# Altium project LiPo ATtiny Watch.PrjPcb
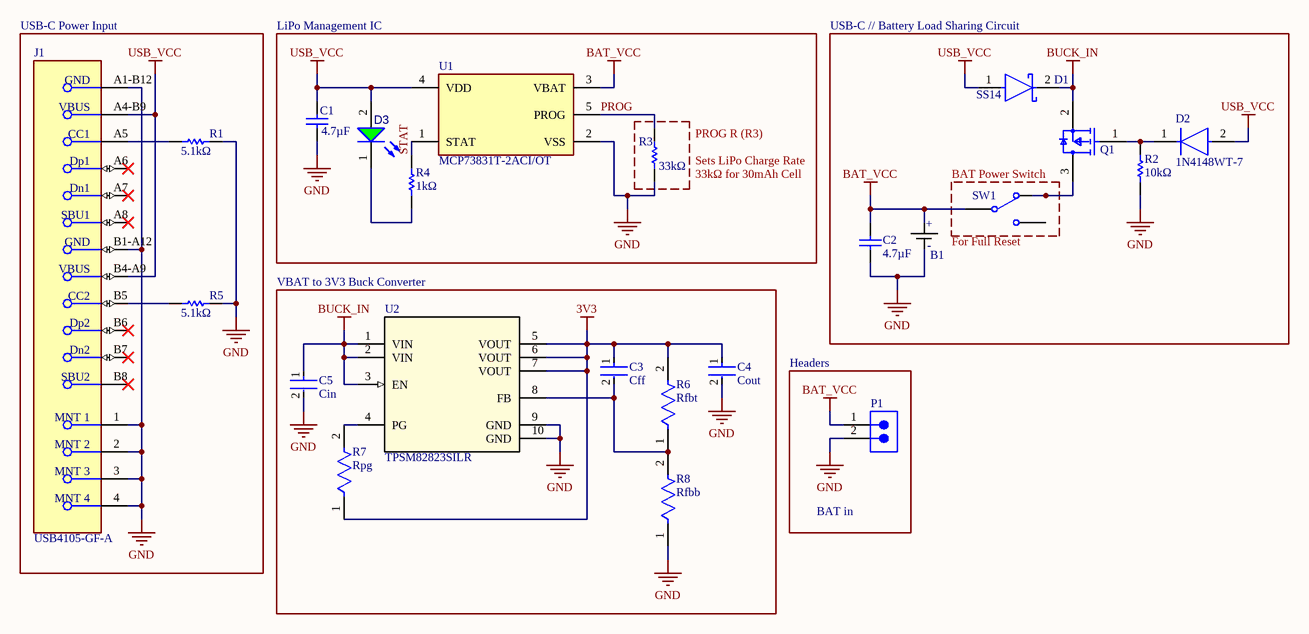
[diagram p0: LiPo BMS.SchDoc]
4 sheets, 49 parts. Net scope: flat (ports and power ports of the same name join across sheets).
Board file: PCB.PcbDoc
Sheets:
  LiPo BMS.SchDoc
  Microcontroller.SchDoc
  RTC IC.SchDoc
  Display.SchDoc

## Sheet LiPo BMS.SchDoc
size B; SheetNumber: 1; SheetTotal: 4

### Parts
B1  LiPo  (value not drawn)
C1  4.7µF  [CAPC1206(3216)190_L]
C2  4.7µF  [CAPC1206(3216)190_L]
C3  Cff  [FP-GRM033-0_03-IPC_A]
C4  Cout  [FP-C0805C-DG-MFG]
C5  Cin  [FP-GRM188-0_1-e0_2_0_55-IPC_A]
D1  SS14  [FP-403AE-MFG]
D2  1N4148WT-7  [FP-SOD523-MFG]
D3  150120GS75000  [WL-SMCW_1206_150120xx75000]  (value not drawn)
J1  USB4105-GF-A  [FP-USB4105-GF-A-MFG]
P1  61300211121  [61300211121]  (value not drawn)
Q1  IRLML6402TRPBF  [FP-Micro3-MFG]  (value not drawn)
R1  5.1kΩ  [RESC3116X65X40LL10T20]
R2  10kΩ  [RESC3116X65X40LL10T20]
R3  33kΩ  [RESC3116X65X40LL10T20]
R4  1kΩ  [RESC3116X65X40LL10T20]
R5  5.1kΩ  [RESC3116X65X40LL10T20]
R6  Rfbt  [FP-CRCW0402-e3-MFG]
R7  Rpg  [FP-CRCW0402-e3-IPC_C]
R8  Rfbb  [FP-CRCW0402-e3-IPC_C]
SW1  450404015514  [450404015514]  (value not drawn)
U1  MCP73831T-2ACI/OT  [FP-C04-091-OT-IPC_B]
U2  TPSM82823SILR  [SIL0010D-MFG]

### Blocks framed on the sheet
USB-C Power Input: J1 R1 R5
BAT Power Switch: SW1
VBAT to 3V3 Buck Converter: C3-C5 R6-R8 U2

### Nets
3V3: C3.1 C4.1 R6.2 R7.1 U2.5(VOUT) U2.6(VOUT) U2.7(VOUT)
BAT_VCC: B1.0(+) C2.2 P1.1 SW1.COM U1.3(VBAT)
BUCK_IN: C5.1 D1.2(C) Q1.2(S) U2.1(VIN) U2.2(VIN) U2.3(EN)
GND: B1.1(-) C1.1 C2.1 C4.2 C5.2 J1.1(MNT_1) J1.2(MNT_2) J1.3(MNT_3) J1.4(MNT_4) J1.A1-B12(GND) J1.B1-A12(GND) P1.2 R1.2 R2.1 R3.1 R5.2 R8.1 U1.2(VSS) U2.9(GND) U2.10(GND)
USB_VCC: C1.2 D1.1(A) D2.2(A) D3.2(A) J1.A4-B9(VBUS) J1.B4-A9(VBUS) U1.4(VDD)
PROG: R3.2 U1.5(PROG)
STAT: R4.1 U1.1(STAT)
NetC3_2: C3.2 R6.1 R8.2 U2.8(FB)
NetD2_1: D2.1(C) Q1.1(G) R2.2
NetD3_1: D3.1(K) R4.2
NetJ1_A5: J1.A5(CC1) R1.1
NetJ1_B5: J1.B5(CC2) R5.1
NetQ1_3: Q1.3(D) SW1.L1
NetR7_2: R7.2 U2.4(PG)

Not connected (* = marked no-connect by the designer): J1 A6(Dp1)* A7(Dn1)* A8(SBU1)* B6(Dp2)* B7(Dn2)* B8(SBU2)*; SW1 L2

### Notes on the sheet
- LiPo Management IC
- USB-C // Battery Load Sharing Circuit
- (near R3) PROG R (R3)
- (near R3) Sets LiPo Charge Rate
- (near R3) 33kΩ for 30mAh Cell
- (near SW1) For Full Reset
- Headers
- BAT in

### Library data of the parts
B1 = 3.7V 30mAh LiPo
C1 C2 = CMP-1037-04917-1: CAP 4.7uF 25V ±5% 1206 (3216 Metric) Thickness 1.9mm SMD; Tolerance: Â±5%; Case-Metric: 3216; Case-EIA: 1206; Max Thickness: 1.9 mm; Rated Voltage: 25 V; Value: 4.7uF; Technology: SMT
C3 = CMP-2010-01296-2: Chip Multilayer Ceramic Capacitors for General Purpose, 0201, 120pF, X7R, 15%, 10%, 25V; Thickness: 0.013inch; Packaging: Tape and Reel; Dielectric: X7R; Series: GRM; Mount: Surface Mount; Height: 0.3mm; Voltage Rating (DC): 25V; Case/Package: 0201; Case Code (Metric): 0603; Case Code (Imperial): 0201; Min Operating Temperature: -55°C; Lead Free: Lead Free; Capacitance: 120pF; Width: 0.012inch; Package Quantity: 1; Voltage Rating: 25V; Termination: SMD/SMT; Radiation Hardening: No; Tolerance: 10%; Length: 0.6mm; Max Operating Temperature: 125°C; Depth: 0.3mm; Construction: Flat
C4 = CMP-2007-03243-2: CAP CER 10UF 10V X5R 0805; Manufacturer Part Number: C0805C106K8PACTU; Manufacturer: Kemet; 3DS Part Number: 220-00001; Tolerance: 10%; Temperature Coefficient: 15%; Material: Ceramic; Device Class L2: Capacitors; Device Class L1: Passive Components; ComponentLink2URL: https://content.kemet.com/datasheets/KEM_C1006_X5R_SMD.pdf; Height: 1.4mm; Lead Free: Yes; Digikey Description: CAP CER 10UF 10V X5R 0805; Octopart: https://octopart.com/c0805c106k8pactu-kemet-98697; Capacitance: 10uF; Value: 10uF; Temperature Range Low: -55°C; Temperature: -55°C to +85°C; Automotive: No; Mouser Description: CAP CER 10UF 10V X5R 0805; Ipc Land Pattern Name: CAPC200125X125; Temperature Range High: +85°C; Voltage: 10V; RoHS: TRUE; Device Class L3: Ceramic Capacitors; ComponentLink2Description: Datasheet; Voltage Rating: 10V; Package: C0805C-DG; Temperature Characteristic: X5R; Category: Cap
C5 = CMP-2006-02792-2: Chip Multilayer Ceramic Capacitors for General Purpose, 0603, 10uF, X5R, 15%, 20%, 6.3V; Packaging: Tape and Reel; Voltage Rating (DC): 6.3V; Width: 0.031inch; Termination: SMD/SMT; Dielectric: X5R; Package Quantity: 4000; Voltage Rating: 6.3V; Capacitance: 10uF; Case/Package: 0603; Min Operating Temperature: -55°C; Voltage: 6.3V; Length: 1.6mm; Thickness: 0.035inch; Lead Free: Lead Free; Depth: 0.8mm; Case Code (Imperial): 0603; Max Operating Temperature: 85°C; Material: Ceramic; Height: 0.8mm; Tolerance: 20%; Mount: Surface Mount; REACH SVHC: No SVHC; Radiation Hardening: No; Case Code (Metric): 1608
D1 = CMP-2000-04943-2: DIODE SCHOTTKY 40V 1A SMA; Manufacturer: ON Semiconductor; Peak Reverse Current: 0.2mA; Max Junction Temp: +125°C; Standoff Height: 0.05mm; Max Surge Forward Current: 40A; Mouser Description: Schottky Diodes & Rectifiers SMA 40V 1.0A; RoHS: TRUE; Lead Free: Yes; Manufacturer Part Number: SS14; Device Class L3: Schottky Diodes; Category: Diode; Automotive: No; Digikey Description: DIODE SCHOTTKY 40V 1A SMA; ComponentLink2Description: Datasheet; Device Class L2: Diodes; Height: 2.5mm; Temperature Range High: +125°C; ComponentLink2URL: https://www.onsemi.com/pub/Collateral/SS19-D.PDF; Device Class L1: Discrete Semiconductors; Package: 403AE; Octopart: https://octopart.com/ss14-on+semiconductor-29205033; Max Repetitive Reverse Voltage: 40V; Temperature Range Low: -65°C; Forward Current: 1A; Temperature: -65°C to +125°C
D2 = CMP-2000-05518-3: DIODE GEN PURP 80V 125MA SOD523; Power Rating: 150mW; Peak Non-Repetitive Surge Current: 2A; Forward Voltage: 1.25V; Reverse Recovery Time: 4ns; Peak Reverse Current: 1uA; Max Repetitive Reverse Voltage (Vrrm): 100V; Capacitance: 2pF; Polarity: Standard; Element Configuration: Single; Forward Current: 250mA; Lead Free: Lead Free; Packaging: Tape and Reel; Length: 0.9mm; Min Operating Temperature: -65°C; Current Rating: 125mA; Max Reverse Voltage (DC): 80V; Width: 1.3mm; Package Quantity: 3000; Output Current: 125mA; Power Dissipation: 150mW; Max Operating Temperature: 150°C; Radiation Hardening: No; Average Rectified Current: 125mA; Height: 0.65mm; Voltage Rating (DC): 80V; Max Surge Current: 2A; Weight: 3.5E-05oz; Recovery Time: 4ns; Max Forward Surge Current (Ifsm): 2A; Contact Plating: Tin; Number of Pins: 2; Mount: Surface Mount; REACH SVHC: No SVHC
D3 = CMP-1426-00014-4: WL-SMCW SMT Mono-Color Chip LED Waterclear; Dominant Wavelength: 525nm; Reverse Voltage: 5V; Max Junction Temperature (Tj): 95°C; Lens Style: Clear, Rectangular; Forward Voltage: 3.2V; Power Dissipation: 105mW; Peak Wavelength: 515nm; Test Current: 20mA; Color: Green; Forward Current: 100mA; Luminous Intensity: 450mcd; Viewing Angle: 140°; Case Code (Imperial): 1206; REACH SVHC: Unknown; Packaging: Tape and Reel; Max Operating Temperature: 85°C; Case/Package: 1206; Height: 680µm; Length: 3.2mm; Mount: Surface Mount; Min Operating Temperature: -40°C; Width: 1.6mm; Case Code (Metric): 3216; Max Reverse Voltage (DC): 5V; RoHS: Compliant; Wavelength: 525nm
J1 = CMP-245163-000001-1: CONN RCPT USB2.0 TYPEC 5A; Manufacturer: GCT; Voltage Rating: 20V; Is Female: yes; Current Rating: 5/6.25/1.25/0.25A; Number Of Contacts: 16; Conn Orientation: Right Angle; Device Class L1: Connectors; Category: Conn; Lead Free: Yes; RoHS: TRUE; Temperature Range High: +85°C; Digikey Description: CONN RCPT USB2.0 TYPEC 5A; Device Class L3: unset; ComponentLink2Description: Datasheet; Manufacturer Part Number: USB4105-GF-A; Package: 0; Usb Standard: USB 2.0; Device Class L2: USB Connectors; Automotive: No; Temperature Range Low: -40°C; Height: 3.46mm; Temperature: -40°C to +85°C; Contact Material: Gold,Nickel; ComponentLink2URL: https://gct.co/files/drawings/usb4105.pdf; Octopart: https://octopart.com/usb4105-gf-a-gct-106627878
P1 = CMP-1712-00002-6: NexarPartId: 20081794; Number of Contacts: 2; Pitch: 2.54mm; Connector Type: Male Pin; Voltage Rating: 250V; Current Rating: 3A; Gender: Male; Contact Resistance: 20mΩ; Height: 8.94mm; Lead Free: Lead Free; Number of Pins: 2; Termination: Through Hole; RoHS: Compliant; Lead Pitch: 2.54mm; REACH SVHC: No SVHC; Housing Material: PBT; Contact Mating Length: 5.9944mm; Min Operating Temperature: -40°C; Orientation: Vertical; Contact Material: Copper; Contact Gender: Male; Max Operating Temperature: 125°C; Number of Rows: 1; Number of Positions: 2; Packaging: Bulk; Contact Plating: Gold; Mount: Through Hole; Color: Black; Operating Supply Voltage: 250V
Q1 = CMP-32901-000130-1: MOSFET P-CH 20V 3.7A SOT-23; Manufacturer: Infineon; Reverse Recovery Time: 29ns; Max Forward Diode Voltage: -1.2V; Input Capacitace At Vds: 633pF @ -10V; Drain To Source Resistance: 0.05Ω; Gate To Source Voltage: 12V; Max Junction Temp: +150°C; Pulse Drain Current: -22A; Threshold Vgs Min: -0.4V; Turn Off Delay Time: 588ns; Number Of Channels: 1; Power Dissipation: 1.3W; Turn On Delay Time: 350ns; Drain To Source Breakdown Voltage: -20V; Continuous Drain Current: -3.7A; Depletion Mode: False; Gate Charge At Vgs: 8nC @ -5V; Rthja Max: 75°C/W; Threshold Vgs: -0.55V; Standoff Height: 0.01mm; Reverse Recovery Charge: 11nC; Device Class L2: Transistors; Ipc Land Pattern Name: SOT95P237X100-3; Temperature Range High: +150°C; Octopart: https://octopart.com/irlml6402trpbf-infineon-65874989; ComponentLink2URL: https://www.infineon.com/dgdl/irlml6402pbf.pdf?fileId=5546d462533600a401535668d5c2263c; Automotive: No; Manufacturer Part Number: IRLML6402TRPBF; Height: 1.12mm; Drain To Source Voltage: -20V; Digikey Description: MOSFET P-CH 20V 3.7A SOT-23; Device Class L1: Discrete Semiconductors; Package: Micro3; Lead Free: Yes; Temperature Range Low: -55°C; Number Of P Channels: 1; Technology: MOSFET; Temperature: -55°C to +150°C; Category: Trans; Footprint Url: http://irf.com/package/outline/po_micro3.pdf; RoHS: TRUE; Device Class L3: MOSFETs; Threshold Vgs Max: -1.2V; ComponentLink2Description: Datasheet
R1 R5 = CMP-2003-03990-1: Manufacturer: Yageo; Part Number: RC1206JR-075K1L
R2 = CMP-1014-00623-2: Chip Resistor, 10 KOhm, +/- 1%, 0.25 W, -55 to 155 degC, 1206 (3216 Metric), RoHS, Tape and Reel; Manufacturer: Yageo; Voltage Rating: 200V; Resistance: 10KOhm; Temperature Coefficient: 100ppm/degreesC; Power Rating: 250mW; Packaging: TapeandReel; Termination: SMD/SMT; REACH SVHC: Unknown; Tolerance: 1%; Height: 0.55mm; Composition: ThickFilm; Max Operating Temperature: 155degC; Datasheet Version: Rev. 5, 10/2016; Lead Free: LeadFree; Case Code (Metric): 3216; Depth: 1.6mm; Package Quantity: 5000; RoHSCompliant: true; Military Standard: Not; Case/Package: 1206; Case Code (Imperial): 1206; Min Operating Temperature: -55degC; Datasheet URL: http://www.yageo.com/NewPortal/yageodocoutput?fileName=/pdf/R-Chip/PYu-RC_Group_51_RoHS_L_5.pdf; Length: 3.1mm; Manufacturer URL: http://www.yageo.com/; Package Reference: 1206.0; Width: 1.6mm; Package Description: 2-Pin Surface Mount Device, Body 3.1 x 1.6 mm
R3 = CMP-2003-03510-1: Part Number: RC1206JR-1033KL; Manufacturer: Yageo
R4 = CMP-2100-03678-1: Chip Resistor, 1 KOhm, +/- 1%, 0.25 W, -55 to 155 degC, 1206 (3216 Metric), RoHS, Tape and Reel; Manufacturer: Yageo; Temperature Coefficient: 100ppm/degreesC; Power Rating: 250mW; Voltage Rating: 200V; Resistance: 1KOhm; Composition: ThickFilm; Min Operating Temperature: -55degC; Tolerance: 1%; REACH SVHC: Unknown; Case Code (Metric): 3216; Military Standard: Not; Datasheet Version: Rev. 5, 10/2016; Package Reference: 1206.0; Case/Package: 1206; Length: 3.1mm; Manufacturer URL: http://www.yageo.com/; Lead Free: LeadFree; RoHSCompliant: true; Termination: SMD/SMT; Packaging: TapeandReel; Package Description: 2-Pin Surface Mount Device, Body 3.1 x 1.6 mm; Depth: 1.6mm; Case Code (Imperial): 1206; Max Operating Temperature: 155degC; Datasheet URL: http://www.yageo.com/NewPortal/yageodocoutput?fileName=/pdf/R-Chip/PYu-RC_Group_51_RoHS_L_5.pdf; Height: 0.55mm
R6 = CMP-2002-00012-2: RES Thick Film, 453kΩ, 1%, 0.063W, 100ppm/°C, 0402; Resistance: 453kR; Voltage Rating (DC): 50V; Power Rating: 63mW; Features: Automotive AEC-Q200; Termination: SMD/SMT; Weight: 2.3E-05oz; Resistor Type: Thick Film; Size Code: 0402; Height: 0.016inch; RoHS Compliant: Yes; Resistance Tolerance: 1%; Construction: Rectangular; Radiation Hardening: No; Temperature Coefficient: 100ppm/°C; Series: CRCW; Depth: 0.5mm; Lead Free: Lead Free; Min Operating Temperature: -55°C; Package Quantity: 10; Length: 1mm; Case Code (Metric): 1005; Tolerance: 1%; Max Operating Temperature: 155°C; Voltage Rating: 50V; Packaging: Tape and Reel; Number of Pins: 2; Case Code (Imperial): 0402; Case/Package: 0402; Number of Terminations: 2; Contact Plating: Tin; Military Standard: Not; Max Power Dissipation: 63mW; Width: 0.5mm
R7 R8 = CMP-2002-08123-3: RES Thick Film, 100kΩ, 1%, 0.063W, 100ppm/°C, 0402; Power Rating: 63mW; Resistance: 100kR; Voltage Rating (DC): 50V; Lead Free: Lead Free; Height: 0.35mm; Contact Plating: Tin; Min Operating Temperature: -55°C; Package Quantity: 10000; Case/Package: 0402; Temperature Coefficient: 100ppm/°C; Number of Terminations: 2; Packaging: Tape and Reel; Max Power Dissipation: 63mW; Case Code (Metric): 1005; Mount: Surface Mount; Width: 0.02inch; Termination: SMD/SMT; Length: 1mm; Number of Pins: 2; Weight: 2.3E-05oz; Radiation Hardening: No; Tolerance: 1%; Military Standard: Not; Features: Automotive AEC-Q200; Depth: 0.5mm; Composition: Thick Film; Max Operating Temperature: 155°C; Voltage Rating: 50V; Case Code (Imperial): 0402
SW1 = CMP-03913-99472344-1: 450404015514 Slide Switch, 0.3A, 5Vdc, Smd Rohs Compliant: Yes; Current Rating: 300mA; Insulation Resistance: 100MΩ; Voltage Rating: 5V; NexarPartId: 99472344; Min Operating Temperature: -40°C; Contact Plating: Silver; Packaging: Tape and Reel; Max Operating Temperature: 85°C; RoHS: Compliant
U1 = CMP-0133-00143-2: IC CONTROLLR LI-ION 4.2V SOT23-5; Max Power Dissipation: 1.54W; Output Current: 500mA; Max Output Voltage: 4.5V; Number of Outputs: 1; Min Output Voltage: 4.168V; Min Supply Voltage: 3.75V; Max Input Voltage: 6V; Voltage Rating: 4.534V; Drain to Source Resistance: 350mR; Max Operating Temperature: 85°C; Length: 0.122inch; Number of Pins: 5; REACH SVHC: No SVHC; Radiation Hardening: No; Min Operating Temperature: -40°C; Weight: 0.00709oz; Contact Plating: Tin; Termination: SMD/SMT; Case/Package: SOT-23; Mount: Surface Mount; Width: 0.071inch; Packaging: Tape and Reel; Number of Cells: 1; Max Charge Current: 500mA; Height: 0.051inch; Number of Channels: 1; Output Voltage: 4.2V; Max Supply Voltage: 6V; Lead Free: Lead Free
U2 = TPSM82823SILR: No Description Available; Mfr_Name: Texas Instruments; TYPE: TYPE; RefDes: RefDes

## Sheet Microcontroller.SchDoc
size A; SheetNumber: 2; SheetTotal: 4
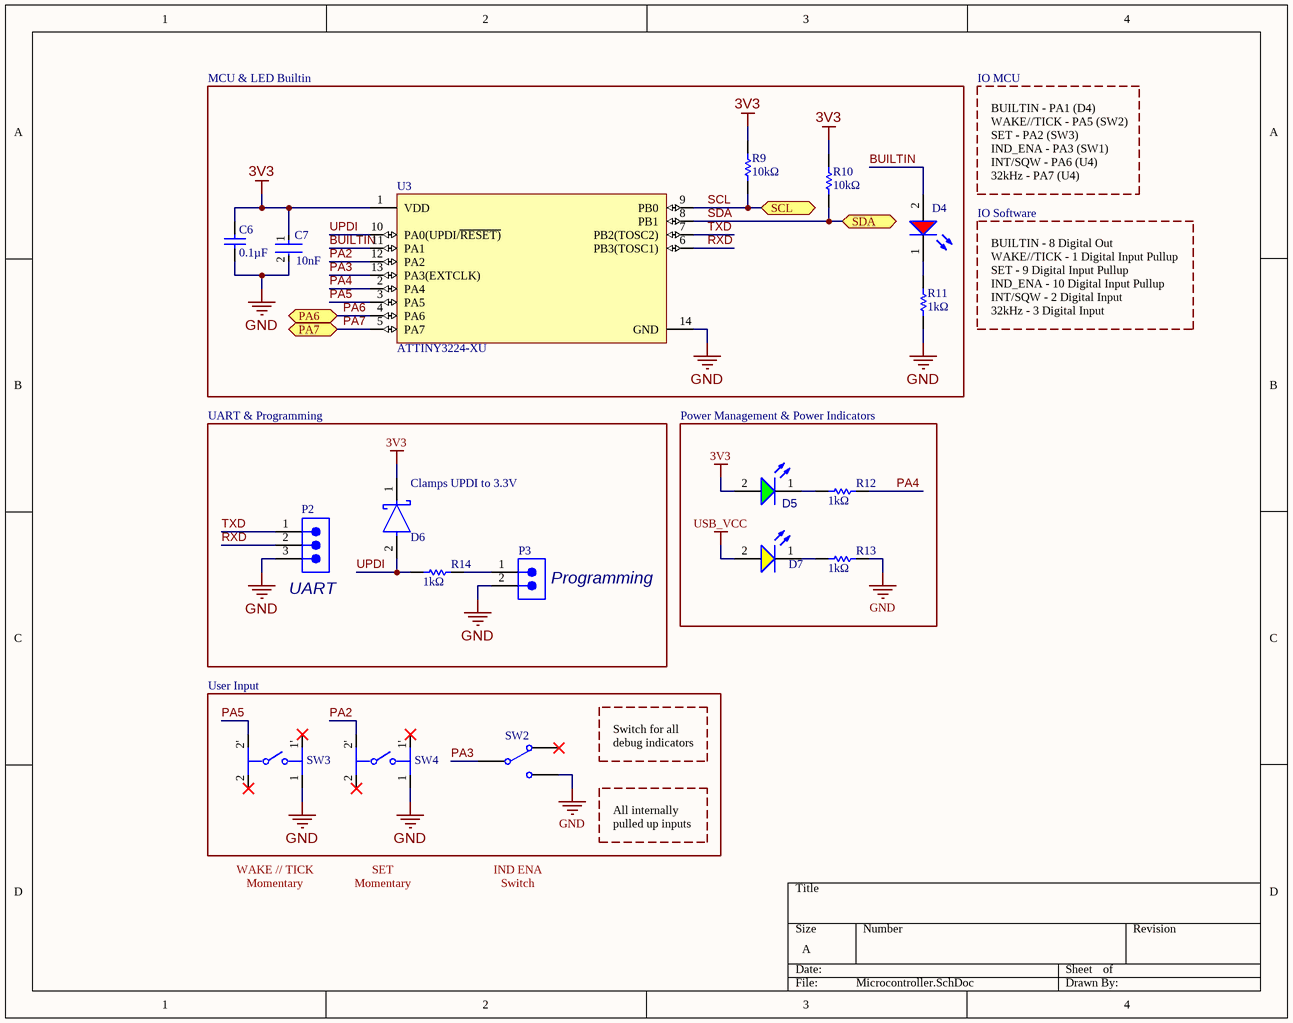
[diagram p1: Microcontroller.SchDoc]

### Parts
C6  0.1µF  [CAPC3216X100X50LL20T25]
C7  10nF  [FP-C1206C-EB-MFG]
D4  150120RS75000  [WL-SMCW_1206_150120xx75000]  (value not drawn)
D5  150120GS75000  [WL-SMCW_1206_150120xx75000]  (value not drawn)
D6  SS14-E3/61T  [FP-95400-MFG]  (value not drawn)
D7  150120YS75000  [WL-SMCW_1206_150120xx75000]  (value not drawn)
P2  61300311121  [61300311121]  (value not drawn)
P3  61300211121  [61300211121]  (value not drawn)
R9  10kΩ  [RESC3116X65X40LL10T20]
R10  10kΩ  [RESC3116X65X40LL10T20]
R11  1kΩ  [RESC3116X65X40LL10T20]
R12  1kΩ  [RESC3116X65X40LL10T20]
R13  1kΩ  [RESC3116X65X40LL10T20]
R14  1kΩ  [RESC3116X65X40LL10T20]
SW2  450404015514  [450404015514]  (value not drawn)
SW3  EVQ-9P701P  [FP-EVQ-9P701P-MFG]  (value not drawn)
SW4  EVQ-9P701P  [FP-EVQ-9P701P-MFG]  (value not drawn)
U3  ATTINY3224-XU  [FP-C04-087-ST-MFG]

### Blocks framed on the sheet
MCU & LED Builtin: C6 C7 D4 R9-R11 U3
Power Management & Power Indicators: D5 D7 R12 R13
User Input: SW2-SW4

### Ports
PA6 (bidir, see RTC IC[3B]), PA7 (bidir, see RTC IC[3B]), SCL (bidir, see Display[2B], RTC IC[2B]), SDA (bidir, see Display[2B], RTC IC[2B])

### Nets
3V3: C6.2 C7.1 D5.2(A) D6.1(C) R9.2 R10.2 U3.1(VDD)
GND: C6.1 C7.2 P2.3 P3.2 R11.1 R13.2 SW2.L2 SW3.1 SW4.1 U3.14(GND)
USB_VCC: D7.2(A)
BUILTIN: D4.2(A) U3.11(PA1)
PA2: SW4.2' U3.12(PA2)
PA3: SW2.COM U3.13(PA3(EXTCLK))
PA4: R12.2 U3.2(PA4)
PA5: SW3.2' U3.3(PA5)
PA6: U3.4(PA6) ; port PA6
PA7: U3.5(PA7) ; port PA7
RXD: P2.2 U3.6(PB3(TOSC1))
SCL: R9.1 U3.9(PB0) ; port SCL
SDA: R10.1 U3.8(PB1) ; port SDA
TXD: P2.1 U3.7(PB2(TOSC2))
UPDI: D6.2(A) R14.1 U3.10(PA0(UPDI/~{RESET)})
NetD4_1: D4.1(K) R11.2
NetD5_1: D5.1(K) R12.1
NetD7_1: D7.1(K) R13.1
NetP3_1: P3.1 R14.2

Not connected (* = marked no-connect by the designer): SW2 L1*; SW3 1'* 2*; SW4 1'* 2*

### Notes on the sheet
- IO MCU
- BUILTIN - PA1 (D4)
- WAKE//TICK - PA5 (SW2)
- SET - PA2 (SW3)
- IND_ENA - PA3 (SW1)
- INT/SQW - PA6 (U4)
- IO Software
- 32kHz - PA7 (U4)
- BUILTIN - 8 Digital Out
- WAKE//TICK - 1 Digital Input Pullup
- SET - 9 Digital Input Pullup
- IND_ENA - 10 Digital Input Pullup
- INT/SQW - 2 Digital Input
- 32kHz - 3 Digital Input
- UART & Programming
- (near D6) Clamps UPDI to 3.3V
- (near P2) UART
- (near P3) Programming
- Switch for all debug indicators
- All internally pulled up inputs
- WAKE // TICK
- Momentary
- SET
- IND ENA
- Switch

### Library data of the parts
C6 = CMP-1664-00001-4: Chip Capacitor, 100 nF, +/- 10%, 25 V, -55 to 125 degC, 1206 (3216 Metric), RoHS, Tape and Reel; Manufacturer: Kemet; Voltage Rating: 25 V; ComponentLink1URL: http://www.kemet.com/; Max Operating Temperature: 125 degC; PackageReference: 1206; ComponentLink2URL: http://www.kemet.com/docfinder?Partnumber=C1206F104K3RACTU; ComponentLink1Description: Manufacturer URL; ComponentLink2Description: Datasheet; Length: 3.2 mm; Packaging: Tape and Reel; Height: 0.78 mm; Mounting Technology: Surface Mount; REACH SVHC: No SVHC; PackageDescription: 2-Pin Surface Mount Device, Body 3.2 x 1.6 mm; Min Operating Temperature: -55 degC; RoHSCompliant: true; DatasheetVersion: 02/2016; Package Quantity: 4000
C7 = CMP-03020-003656-1: CAP CER 10000PF 100V X7R 1206; Manufacturer: KEMET; Manufacturer Part Number: C1206C103J1RACTU; Temperature Coefficient: 15%; Capacitance: 10,000 pF; Automotive Grade: Grade 0; Value: 10,000 pF; Material: Ceramic; Tolerance: 0.05; Digikey Description: CAP CER 10000PF 100V X7R 1206; Temperature Range Low: -55°C; Height: 0.88mm; Automotive: Yes; Ipc Land Pattern Name: CAPC320160X78; ComponentLink2URL: https://content.kemet.com/datasheets/KEM_C1007_X8R_ULTRA_150C_SMD.pdf; Device Class L2: Capacitors; Mouser Description: 1206 C 10nF Ceramic Multilayer Capacitor, 100 VDC, +125degC, X7R Dielec, +/-5%; Octopart: https://octopart.com/c1206c103j1ractu-kemet-121270; Category: Cap; Temperature Characteristic: X7R; Voltage Rating: 100 V; Temperature: -55°C to +150°C; Device Class L1: Passive Components; RoHS: TRUE; Device Class L3: Ceramic Capacitors; Package: C1206C-EB; Lead Free: Yes; ComponentLink2Description: Datasheet; Temperature Range High: +150°C
D4 = CMP-1426-00013-4: WL-SMCW SMT Mono-Color Chip LED Waterclear; Luminous Intensity: 150mcd; Max Junction Temperature (Tj): 95°C; Lens Style: Clear, Rectangular; Color: Red; Wavelength: 625nm; Forward Current: 100mA; Test Current: 20mA; Power Dissipation: 72mW; Forward Voltage: 2V; Peak Wavelength: 630nm; Reverse Voltage: 5V; Viewing Angle: 140°; Length: 3.2mm; Case Code (Imperial): 1206; Mount: Surface Mount; Case/Package: 1206; Packaging: Tape and Reel; REACH SVHC: Unknown; Max Operating Temperature: 85°C; RoHS: Compliant; Height: 680µm; Dominant Wavelength: 625nm; Width: 1.6mm; Max Reverse Voltage (DC): 5V; Case Code (Metric): 3216; Min Operating Temperature: -40°C
D5 = CMP-1426-00014-4: as D3 on sheet LiPo BMS; Case Code (Imperial): 1206; REACH SVHC: Unknown; Packaging: Tape and Reel; Max Operating Temperature: 85°C; Case/Package: 1206; Height: 680µm; Length: 3.2mm; Mount: Surface Mount; Min Operating Temperature: -40°C; Width: 1.6mm; Case Code (Metric): 3216; Max Reverse Voltage (DC): 5V; RoHS: Compliant; Wavelength: 525nm
D6 = CMP-02539-000035-1: DIODE SCHOTTKY 40V 1A DO214AC; Manufacturer: Vishay; Peak Reverse Current: 0.2mA; Standoff Height: 0mm; Max Junction Temp: +150°C; Max Surge Forward Current: 40A; RoHS: TRUE; Digikey Description: DIODE SCHOTTKY 40V 1A DO214AC; Category: Diode; Device Class L3: Schottky Diodes; Temperature Range High: +150°C; Automotive: No; Temperature: -65°C to +150°C; Device Class L2: Diodes; Forward Current: 1A; Temperature Range Low: -65°C; Footprint Url: http://www.vishay.com/docs/95400/sma.pdf; Octopart: https://octopart.com/ss14-e3%2F61t-vishay-39552847; Package: 95400; Max Repetitive Reverse Voltage: 40V; ComponentLink2Description: Datasheet; ComponentLink2URL: http://www.vishay.com/docs/88746/ss12.pdf; Lead Free: Yes; Height: 2.29mm; Mouser Description: SS14 Series 40 V 1 A Surface Mount Schottky Barrier Rectifier - DO-214AC (SMA); Manufacturer Part Number: SS14-E3/61T; Device Class L1: Discrete Semiconductors
D7 = CMP-1426-00019-3: Led, Yellow, 590 Nm, 2 V, 30 Ma, 120 Mcd Rohs Compliant: Yes; Dominant Wavelength: 590nm; Forward Voltage: 2V; Forward Current: 100mA; Viewing Angle: 140°; Max Reverse Voltage (DC): 5V; Peak Wavelength: 595nm; Lens Style: Clear, Rectangular; Test Current: 20mA; Luminous Intensity: 120mcd; REACH SVHC: Unknown; Length: 3.2mm; RoHS: Compliant; Packaging: Tape and Reel; Min Operating Temperature: -40°C; Mount: Surface Mount; Max Operating Temperature: 85°C; Wavelength: 590nm; Case/Package: 1206; Case Code (Imperial): 1206; Color: Yellow; Height: 680µm; Case Code (Metric): 3216; Width: 1.6mm
P2 = CMP-1502-01062-3: NexarPartId: 32855521; Current Rating: 3A; Voltage Rating: 250V; Number of Positions: 3; Pitch: 2.54mm; Contact Resistance: 20mΩ; Connector Type: Male Pin; Gender: Male; REACH SVHC: Unknown; Packaging: Bulk; Contact Material: Copper; Min Operating Temperature: -40°C; Number of Rows: 1; Orientation: Vertical; RoHS: Compliant; Contact Plating: Gold; Max Operating Temperature: 105°C; Mount: Through Hole; Height: 8.94mm; Operating Supply Voltage: 250V; Number of Pins: 3; Contact Mating Length: 5.9944mm; Number of Contacts: 3; Color: Black; Lead Free: Lead Free; Lead Pitch: 2.54mm; Termination: Solder
P3 = CMP-1712-00002-6: as P1 on sheet LiPo BMS; Height: 8.94mm; Lead Free: Lead Free; Number of Pins: 2; Termination: Through Hole; RoHS: Compliant; Lead Pitch: 2.54mm; REACH SVHC: No SVHC; Housing Material: PBT; Contact Mating Length: 5.9944mm; Min Operating Temperature: -40°C; Orientation: Vertical; Contact Material: Copper; Contact Gender: Male; Max Operating Temperature: 125°C; Number of Rows: 1; Number of Positions: 2; Packaging: Bulk; Contact Plating: Gold; Mount: Through Hole; Color: Black; Operating Supply Voltage: 250V
R9 R10 = CMP-1014-00623-2: as R2 on sheet LiPo BMS; Packaging: TapeandReel; Termination: SMD/SMT; REACH SVHC: Unknown; Tolerance: 1%; Height: 0.55mm; Composition: ThickFilm; Max Operating Temperature: 155degC; Datasheet Version: Rev. 5, 10/2016; Lead Free: LeadFree; Case Code (Metric): 3216; Depth: 1.6mm; Package Quantity: 5000; RoHSCompliant: true; Military Standard: Not; Case/Package: 1206; Case Code (Imperial): 1206; Min Operating Temperature: -55degC; Datasheet URL: http://www.yageo.com/NewPortal/yageodocoutput?fileName=/pdf/R-Chip/PYu-RC_Group_51_RoHS_L_5.pdf; Length: 3.1mm; Manufacturer URL: http://www.yageo.com/; Package Reference: 1206.0; Width: 1.6mm; Package Description: 2-Pin Surface Mount Device, Body 3.1 x 1.6 mm
R11-R14 = CMP-2100-03678-1: as R4 on sheet LiPo BMS; Composition: ThickFilm; Min Operating Temperature: -55degC; Tolerance: 1%; REACH SVHC: Unknown; Case Code (Metric): 3216; Military Standard: Not; Datasheet Version: Rev. 5, 10/2016; Package Reference: 1206.0; Case/Package: 1206; Length: 3.1mm; Manufacturer URL: http://www.yageo.com/; Lead Free: LeadFree; RoHSCompliant: true; Termination: SMD/SMT; Packaging: TapeandReel; Package Description: 2-Pin Surface Mount Device, Body 3.1 x 1.6 mm; Depth: 1.6mm; Case Code (Imperial): 1206; Max Operating Temperature: 155degC; Datasheet URL: http://www.yageo.com/NewPortal/yageodocoutput?fileName=/pdf/R-Chip/PYu-RC_Group_51_RoHS_L_5.pdf; Height: 0.55mm
SW2 = CMP-03913-99472344-1: as SW1 on sheet LiPo BMS; NexarPartId: 99472344; Min Operating Temperature: -40°C; Contact Plating: Silver; Packaging: Tape and Reel; Max Operating Temperature: 85°C; RoHS: Compliant
SW3 SW4 = CMP-05618-000010-1: SWITCH TACTILE SPST-NO 0.05A 12V; Manufacturer: Panasonic; Contact Resistance: 500mΩ; Contact Current Rating: 50mA; Operating Force: 1.6N; Electromechanical Life: 100000Cycles; Height: 1.55mm; RoHS: TRUE; Digikey Description: SWITCH TACTILE SPST-NO 0.05A 12V; Automotive: No; Device Class L2: Switches; ComponentLink2URL: https://www3.panasonic.biz/ac/e_download/control/switch/light-touch/catalog/sw_lt_eng_3529s_side.pdf?f_cd=402906&via=ok; Lead Free: Yes; Device Class L3: Tactile Switches; Manufacturer Part Number: EVQ-9P701P; Device Class L1: Electromechanical; Category: Switch; Package: EVQ-9P701P; Mouser Description: Tactile Switches SMD 3.5X2.9MM SID-OP L SHAPED TERM 1.6N; Throw Configuration: SPST-NO; Octopart: https://octopart.com/evq-9p701p-panasonic-58006746; Voltage Rating Dc: 12V; Temperature Range Low: -20°C; ComponentLink2Description: Datasheet; Temperature: -20°C to +70°C; Temperature Range High: +70°C
U3 = CMP-00252-122240563-1: ATTINY3224-XU Microcontroller 8-Bit AVR RISC 32KB Flash 1.8V to 5.5V 14-Pin TSSOP Tube; NexarPartId: 122240563

## Sheet RTC IC.SchDoc
size A; SheetNumber: 3; SheetTotal: 4
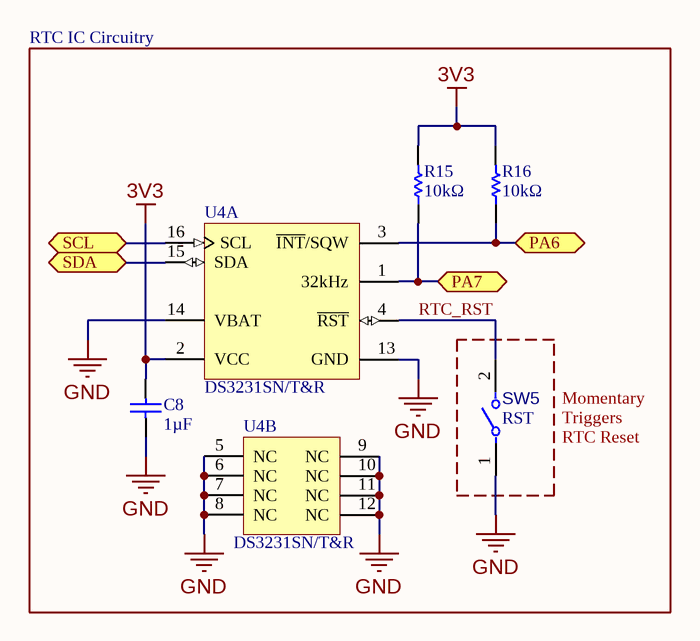
[diagram p2: RTC IC.SchDoc]

### Parts
C8  1µF  [CAPC3216X110X50LL20T25]
R15  10kΩ  [RESC3116X65X40LL10T20]
R16  10kΩ  [RESC3116X65X40LL10T20]
SW5  RST  [FP-B3U-1000P-B-MFG]
U4  DS3231SN/T&R  [W16-H2_N]  (parts A,B of 2)

### Ports
PA6 (bidir, see Microcontroller[1B]), PA7 (bidir, see Microcontroller[1B]), SCL (bidir, see Display[2B], Microcontroller[3A]), SDA (bidir, see Display[2B], Microcontroller[3A])

### Nets
3V3: C8.2 R15.2 R16.2 U4.2(VCC)
GND: C8.1 SW5.1 U4.5(NC) U4.6(NC) U4.7(NC) U4.8(NC) U4.9(NC) U4.10(NC) U4.11(NC) U4.12(NC) U4.13(GND) U4.14(VBAT)
PA6: R16.1 U4.3(~{INT}/SQW) ; port PA6
PA7: R15.1 U4.1(32kHz) ; port PA7
RTC_RST: SW5.2 U4.4(~{RST})
SCL: U4.16(SCL) ; port SCL
SDA: U4.15(SDA) ; port SDA

### Notes on the sheet
- RTC IC Circuitry
- (near SW5) Momentary
- (near SW5) Triggers
- (near SW5) RTC Reset

### Library data of the parts
C8 = CMP-2000-06011-1: Chip Capacitor, 1 uF, +/- 10%, 50 V, -55 to 125 degC, 1206 (3216 Metric), RoHS, Tape and Reel; Manufacturer: Kemet; Case Height: 1mm; Dielectric: X7R; Voltage Rating: 50V; Capacitance: 1uF; Temperature Coefficient / Code: +/-15%; Case Length: 3.2mm; Case Width: 1.6mm; Type: SMDMLCCX7R6.3-250VDCCommericalGrade; Class: Class1; Capacitance - nF: 1000nF; Datasheet URL: http://www.kemet.com/docfinder?Partnumber=C1206C105K5RACTU; Product Category: MultilayerCeramicCapacitorsMLCC-SMD/SMT; Termination Style: SMD/SMT; Dimensions: 1.6mmWx3.2mmLx1mmH; Voltage Rating DC: 50V; Datasheet Version: 02/2016; Packaging: Reel; Brand: Kemet; RoHS: Details; Minimum Operating Temperature: -55C; Operating Temperature Range: -55Cto+125C; Package Reference: 1206; Manufacturer URL: http://www.kemet.com/; Product: GeneralTypeMLCCs; Tolerance: 10%; Package Description: 2-Pin Surface Mount Device, Body 3.2 x 1.6 mm; Mounting Technology: SurfaceMount; Case Code - mm: 3216; Maximum Operating Temperature: +125C; Series: C1206C; Factory Pack Quantity: 2500; Package / Case: 1206(3216metric); Case Code - in: 1206
R15 R16 = CMP-1014-00623-2: as R2 on sheet LiPo BMS; Packaging: TapeandReel; Termination: SMD/SMT; REACH SVHC: Unknown; Tolerance: 1%; Height: 0.55mm; Composition: ThickFilm; Max Operating Temperature: 155degC; Datasheet Version: Rev. 5, 10/2016; Lead Free: LeadFree; Case Code (Metric): 3216; Depth: 1.6mm; Package Quantity: 5000; RoHSCompliant: true; Military Standard: Not; Case/Package: 1206; Case Code (Imperial): 1206; Min Operating Temperature: -55degC; Datasheet URL: http://www.yageo.com/NewPortal/yageodocoutput?fileName=/pdf/R-Chip/PYu-RC_Group_51_RoHS_L_5.pdf; Length: 3.1mm; Manufacturer URL: http://www.yageo.com/; Package Reference: 1206.0; Width: 1.6mm; Package Description: 2-Pin Surface Mount Device, Body 3.1 x 1.6 mm
SW5 = CMP-08834-000005-1: SWITCH TACTILE SPST-NO 0.05A 12V; Manufacturer Part Number: B3U-1000P-B; Manufacturer: Omron; Operating Force: 1.5N; Contact Current Rating: 50mA; Contact Resistance: 100mΩ; Electromechanical Life: 200000Cycles; Height: 1.75mm; Device Class L2: Switches; Temperature Range High: +70°C; Digikey Description: SWITCH TACTILE SPST-NO 0.05A 12V; Throw Configuration: SPST-NO; Ambient Temperature Range High: +70°C; Temperature: -25°C to +70°C; Lead Free: Yes; ComponentLink2URL: https://omronfs.omron.com/en_US/ecb/products/pdf/en-b3u.pdf; Device Class L3: Tactile Switches; Ambient Temperature Range Low: -25°C; Mount: Surface Mount; Automotive: No; Mouser Description: Tactile Switches Top Actuated with boss w/o ground; Octopart: https://octopart.com/b3u-1000p-b-omron-1057356; RoHS: TRUE; Package: 0; Device Class L1: Electromechanical; Voltage Rating Dc: 12V; Category: Switch; Temperature Range Low: -25°C; ComponentLink2Description: Datasheet
U4 = CMP-0254-00377-1: Extremely Accurate I2C-Integrated Real-Time Clock/TCXO/Crystal, 16-Pin SO, -40 to 85 degC, Reel; PackageReference: W16-H2; DatasheetVersion: Rev 8, Jul-2010; ComponentLink1URL: http://www.maxim-ic.com; ComponentLink1Description: Manufacturer URL; ComponentLink2URL: http://datasheets.maxim-ic.com/en/ds/DS3231.pdf; ComponentLink3Description: Package Specification; ComponentLink2Description: Datasheet; Code_JEDEC: MS-013-AA; PackageVersion: revD, 2010; Code_IPC: SOIC127P1030-16; ComponentLink3URL: http://pdfserv.maxim-ic.com/package_dwgs/21-0042.PDF; PackageDescription: 16-Pin Small-Outline IC, Wide (0.3in), 1.27 mm Pitch, SOIC (W)

## Sheet Display.SchDoc
size A; SheetNumber: 4; SheetTotal: 4
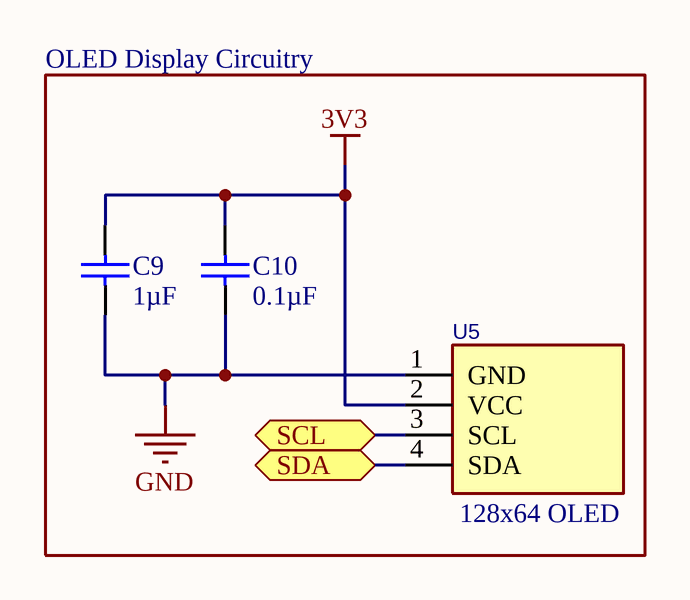
[diagram p3: Display.SchDoc]

### Parts
C9  1µF  [CAPC3216X110X50LL20T25]
C10  0.1µF  [CAPC3216X100X50LL20T25]
U5  128x64 OLED  [Amazon OLED Display Module]

### Blocks framed on the sheet
OLED Display Circuitry: C9 C10 U5

### Ports
SCL (bidir, see Microcontroller[3A], RTC IC[2B]), SDA (bidir, see Microcontroller[3A], RTC IC[2B])

### Nets
3V3: C9.2 C10.2 U5.2(VCC)
GND: C9.1 C10.1 U5.1(GND)
SCL: U5.3(SCL) ; port SCL
SDA: U5.4(SDA) ; port SDA

### Library data of the parts
C9 = CMP-2000-06011-1: as C8 on sheet RTC IC; Datasheet URL: http://www.kemet.com/docfinder?Partnumber=C1206C105K5RACTU; Product Category: MultilayerCeramicCapacitorsMLCC-SMD/SMT; Termination Style: SMD/SMT; Dimensions: 1.6mmWx3.2mmLx1mmH; Voltage Rating DC: 50V; Datasheet Version: 02/2016; Packaging: Reel; Brand: Kemet; RoHS: Details; Minimum Operating Temperature: -55C; Operating Temperature Range: -55Cto+125C; Package Reference: 1206; Manufacturer URL: http://www.kemet.com/; Product: GeneralTypeMLCCs; Tolerance: 10%; Package Description: 2-Pin Surface Mount Device, Body 3.2 x 1.6 mm; Mounting Technology: SurfaceMount; Case Code - mm: 3216; Maximum Operating Temperature: +125C; Series: C1206C; Factory Pack Quantity: 2500; Package / Case: 1206(3216metric); Case Code - in: 1206
C10 = CMP-1664-00001-4: as C6 on sheet Microcontroller; ComponentLink1URL: http://www.kemet.com/; Max Operating Temperature: 125 degC; PackageReference: 1206; ComponentLink2URL: http://www.kemet.com/docfinder?Partnumber=C1206F104K3RACTU; ComponentLink1Description: Manufacturer URL; ComponentLink2Description: Datasheet; Length: 3.2 mm; Packaging: Tape and Reel; Height: 0.78 mm; Mounting Technology: Surface Mount; REACH SVHC: No SVHC; PackageDescription: 2-Pin Surface Mount Device, Body 3.2 x 1.6 mm; Min Operating Temperature: -55 degC; RoHSCompliant: true; DatasheetVersion: 02/2016; Package Quantity: 4000
U5 = CMP-00256-A.5: Hosyond 5 Pcs 0.96 Inch OLED I2C Display Module 128x64 Pixel OLED Display; Amazon Link: https://www.amazon.com/dp/B09C5K91H7?ref=ppx_yo2ov_dt_b_product_details&th=1; Parameter 1: *

## Nets that join several sheets
3V3: LiPo BMS (7 pins), Microcontroller (7 pins), RTC IC (C8.2 R15.2 R16.2 U4.2), Display (C9.2 C10.2 U5.2)
GND: LiPo BMS (20 pins), Microcontroller (10 pins), RTC IC (12 pins), Display (C9.1 C10.1 U5.1)
USB_VCC: LiPo BMS (7 pins), Microcontroller (D7.2)
PA6: Microcontroller (U3.4), RTC IC (R16.1 U4.3)
PA7: Microcontroller (U3.5), RTC IC (R15.1 U4.1)
SCL: Microcontroller (R9.1 U3.9), RTC IC (U4.16), Display (U5.3)
SDA: Microcontroller (R10.1 U3.8), RTC IC (U4.15), Display (U5.4)